# Altium project ChipTestBoardQFN32-r2.PrjPcb
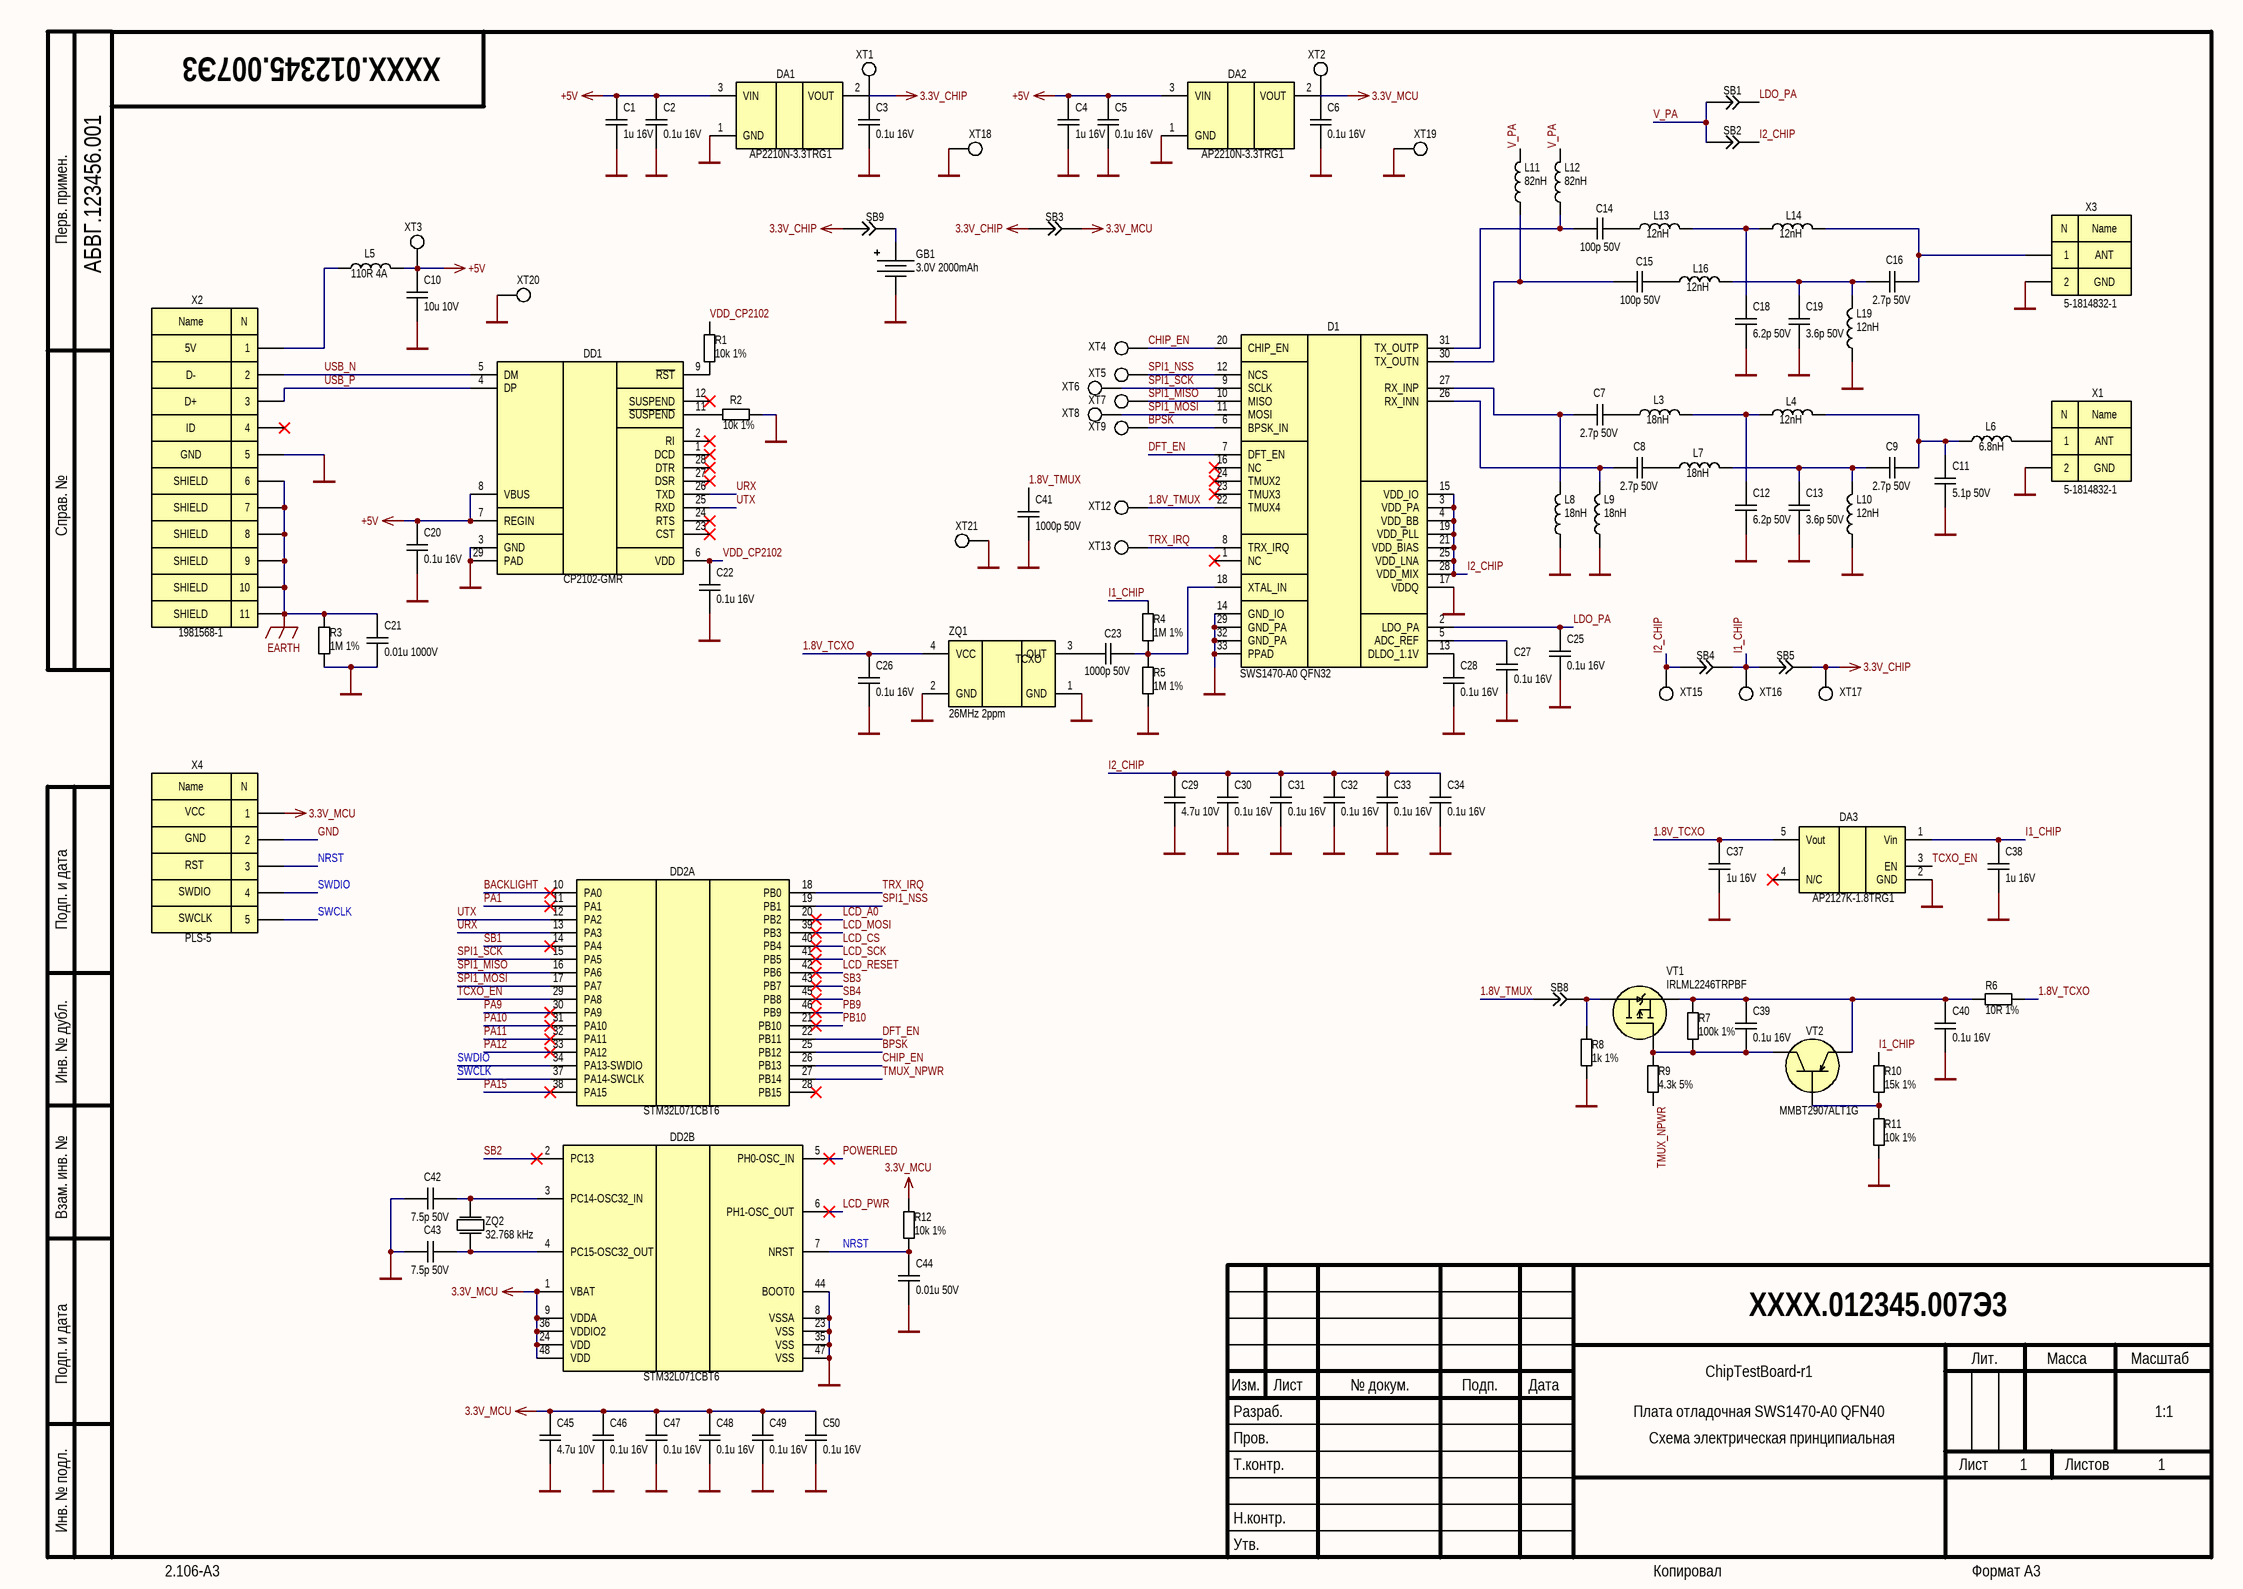
[diagram p0: ChipTestBoardQFN32-r2.SchDoc]
1 sheet, 112 parts. Net scope: global (net labels, ports and power ports of the same name join across sheets).
Board file: ChipTestBoardQFN32-r2.PcbDoc

## Sheet ChipTestBoardQFN32-r2.SchDoc: ChipTestBoard-r1
size 420 x 297 mm; DocumentNumber: XXXX.012345.007Э3; SheetNumber: 1; SheetTotal: 1; Scale: 1:1; Title2str: Плата отладочная SWS1470-A0 QFN40; DocumentType: Схема электрическая принципиальная; FirstReferrence: АБВГ.123456.001

### Parts
C1  1u 16V  [C0603]
C2  0.1u 16V  [C0603]
C3  0.1u 16V  [C0603]
C4  1u 16V  [C0603]
C5  0.1u 16V  [C0603]
C6  0.1u 16V  [C0603]
C7  2.7p 50V  [C0603]
C8  2.7p 50V  [C0603]
C9  2.7p 50V  [C0603]
C10  10u 10V  [C0805]
C11  5.1p 50V  [C0603]
C12  6.2p 50V  [C0603]
C13  3.6p 50V  [C0603]
C14  100p 50V  [C0603]
C15  100p 50V  [C0603]
C16  2.7p 50V  [C0603]
C18  6.2p 50V  [C0603]
C19  3.6p 50V  [C0603]
C20  0.1u 16V  [C0603]
C21  0.01u 1000V  [C1206]
C22  0.1u 16V  [C0603]
C23  1000p 50V  [C0603]
C25  0.1u 16V  [C0603]
C26  0.1u 16V  [C0603]
C27  0.1u 16V  [C0603]
C28  0.1u 16V  [C0603]
C29  4.7u 10V  [C0603]
C30  0.1u 16V  [C0603]
C31  0.1u 16V  [C0603]
C32  0.1u 16V  [C0603]
C33  0.1u 16V  [C0603]
C34  0.1u 16V  [C0603]
C37  1u 16V  [C0603]
C38  1u 16V  [C0603]
C39  0.1u 16V  [C0603]
C40  0.1u 16V  [C0603]
C41  1000p 50V  [C0603]
C42  7.5p 50V  [C0603]
C43  7.5p 50V  [C0603]
C44  0.01u 50V  [C0603]
C45  4.7u 10V  [C0603]
C46  0.1u 16V  [C0603]
C47  0.1u 16V  [C0603]
C48  0.1u 16V  [C0603]
C49  0.1u 16V  [C0603]
C50  0.1u 16V  [C0603]
D1  SWS1470-A0 QFN32  [QFN32]
DA1  AP2210N-3.3TRG1  [SOT23-3L]
DA2  AP2210N-3.3TRG1  [SOT23-3L]
DA3  AP2127K-1.8TRG1  [SOT23-5]
DD1  CP2102-GMR  [QFN28]
DD2  STM32L071CBT6  [LQFP48_L]  (parts A,B of 2)
GB1  3.0V 2000mAh  [BAT14505-Board]
L3  18nH  [L0603_LQW]
L4  12nH  [L0603_LQW]
L5  110R 4A  [L1806]
L6  6.8nH  [L0603_LQW]
L7  18nH  [L0603_LQW]
L8  18nH  [L0603_LQW]
L9  18nH  [L0603_LQW]
L10  12nH  [L0603_LQW]
L11  82nH  [L0603_LQW]
L12  82nH  [L0603_LQW]
L13  12nH  [L0603_LQW]
L14  12nH  [L0603_LQW]
L16  12nH  [L0603_LQW]
L19  12nH  [L0603_LQW]
R1  10k 1%  [R0603]
R2  10k 1%  [R0603]
R3  1M 1%  [R0603]
R4  1M 1%  [R0603]
R5  1M 1%  [R0603]
R6  10R 1%  [R0603]
R7  100k 1%  [R0603]
R8  1k 1%  [R0603]
R9  4.3k 5%  [R0603]
R10  15k 1%  [R0603]
R11  10k 1%  [R0603]
R12  10k 1%  [R0603]
SB1  Jumper Solder  [SB0805]  (value not drawn)  (no BOM)
SB2  Jumper Solder  [SB0805]  (value not drawn)  (no BOM)
SB3  Jumper Solder  [SB0805]  (value not drawn)  (no BOM)
SB4  Jumper Solder  [SB0805]  (value not drawn)  (no BOM)
SB5  Jumper Solder  [SB0805]  (value not drawn)  (no BOM)
SB8  Jumper Solder  [SB0805]  (value not drawn)  (no BOM)
SB9  Jumper Solder  [SB0805]  (value not drawn)  (no BOM)
VT1  IRLML2246TRPBF  [SOT23-3L]
VT2  MMBT2907ALT1G  [SOT23-3L]
X1  5-1814832-1  [5-1814832-1]
X2  1981568-1  [1981568-1]
X3  5-1814832-1  [5-1814832-1]
X4  PLS-5  [PLS-5-2.54-PCB]
XT1  3.3V_MCU  [PAD-d1.0-x1.6-y1.6]  (value not drawn)  (no BOM)
XT2  3.3V_CHIP  [PAD-d1.0-x1.6-y1.6]  (value not drawn)  (no BOM)
XT3  +5V_EXT  [PAD-d1.0-x1.6-y1.6]  (value not drawn)  (no BOM)
XT4  CHIP_EN  [PAD-d1.0-x1.6-y1.6]  (value not drawn)  (no BOM)
XT5  NSS  [PAD-d1.0-x1.6-y1.6]  (value not drawn)  (no BOM)
XT6  SCK  [PAD-d1.0-x1.6-y1.6]  (value not drawn)  (no BOM)
XT7  MISO  [PAD-d1.0-x1.6-y1.6]  (value not drawn)  (no BOM)
XT8  MOSI  [PAD-d1.0-x1.6-y1.6]  (value not drawn)  (no BOM)
XT9  BPSK_IN  [PAD-d1.0-x1.6-y1.6]  (value not drawn)  (no BOM)
XT12  1.8V_TMUX  [PAD-d1.0-x1.6-y1.6]  (value not drawn)  (no BOM)
XT13  TRX_IR  [PAD-d1.0-x1.6-y1.6]  (value not drawn)  (no BOM)
XT15  I2_CHIP  [PAD-d1.0-x1.6-y1.6]  (value not drawn)  (no BOM)
XT16  I1_CHIP  [PAD-d1.0-x1.6-y1.6]  (value not drawn)  (no BOM)
XT17  3.3V_CHIP  [PAD-d1.0-x1.6-y1.6]  (value not drawn)  (no BOM)
XT18  GND  [PAD-d1.0-x1.6-y1.6]  (value not drawn)  (no BOM)
XT19  GND  [PAD-d1.0-x1.6-y1.6]  (value not drawn)  (no BOM)
XT20  GND  [PAD-d1.0-x1.6-y1.6]  (value not drawn)  (no BOM)
XT21  GND  [PAD-d1.0-x1.6-y1.6]  (value not drawn)  (no BOM)
ZQ1  26MHz 2ppm  [QSMD2.0x1.6x0.7]
ZQ2  32.768 kHz  [QSMD3.2X1.5X0.8]

### Nets
3.3V_CHIP: C3.2 DA1.2(VOUT) SB3.1 SB5.2 SB9.1 XT1.1 XT17.1
3.3V_MCU: C6.2 C45.2 C46.2 C47.2 C48.2 C49.2 C50.2 DA2.2(VOUT) DD2.1(VBAT) DD2.9(VDDA) DD2.24(VDD) DD2.36(VDDIO2) DD2.48(VDD) R12.2 SB3.2 X4.1 XT2.1
+5V: C1.2 C2.2 C4.2 C5.2 C10.2 C20.2 DA1.3(VIN) DA2.3(VIN) DD1.7(REGIN) DD1.8(VBUS) L5.2 XT3.1
EARTH: C21.1 R3.2 X2.6 X2.7 X2.8 X2.9 X2.10 X2.11
GND: C1.1 C2.1 C3.1 C4.1 C5.1 C6.1 C10.1 C11.1 C12.2 C13.2 C18.2 C19.2 C20.1 C21.2 C22.1 C25.1 C26.1 C27.1 C28.1 C29.1 C30.1 C31.1 C32.1 C33.1 C34.1 C37.1 C38.1 C40.1 C41.2 C42.1 C43.1 C44.1 C45.1 C46.1 C47.1 C48.1 C49.1 C50.1 D1.14(GND_IO) D1.17(VDDQ) D1.29(GND_PA) D1.32(GND_PA) D1.33(PPAD) DA1.1(GND) DA2.1(GND) DA3.2(GND) DD1.3(GND) DD1.29(PAD) DD2.8(VSSA) DD2.23(VSS) DD2.35(VSS) DD2.44(BOOT0) DD2.47(VSS) GB1.2 L8.1 L9.1 L10.1 L19.1 R2.1 R3.1 R5.1 R8.1 R11.1 X1.2 X2.5 X3.2 X4.2 XT18.1 XT19.1 XT20.1 XT21.1 ZQ1.1(GND) ZQ1.2(GND)
1.8V_TCXO: C26.2 C37.2 DA3.5(Vout) R6.2 ZQ1.4(VCC)
1.8V_TMUX: C41.1 D1.22(TMUX4) SB8.1 XT12.1
BACKLIGHT: DD2.10(PA0)
BPSK: D1.6(BPSK_IN) DD2.25(PB12) XT9.1
CHIP_EN: D1.20(CHIP_EN) DD2.26(PB13) XT4.1
DFT_EN: D1.7(DFT_EN) DD2.22(PB11)
I1_CHIP: C38.2 DA3.1(Vin) R4.2 R10.2 SB4.2 SB5.1 XT16.1
I2_CHIP: C29.2 C30.2 C31.2 C32.2 C33.2 C34.2 D1.3(VDD_PA) D1.4(VDD_BB) D1.15(VDD_IO) D1.19(VDD_PLL) D1.21(VDD_BIAS) D1.25(VDD_LNA) D1.28(VDD_MIX) SB2.2 SB4.1 XT15.1
LCD_A0: DD2.20(PB2)
LCD_CS: DD2.40(PB4)
LCD_MOSI: DD2.39(PB3)
LCD_PWR: DD2.6(PH1-OSC_OUT)
LCD_RESET: DD2.42(PB6)
LCD_SCK: DD2.41(PB5)
LDO_PA: C25.2 D1.2(LDO_PA) SB1.2
NRST: C44.2 DD2.7(NRST) R12.1 X4.3
PA1: DD2.11(PA1)
PA9: DD2.30(PA9)
PA10: DD2.31(PA10)
PA11: DD2.32(PA11)
PA12: DD2.33(PA12)
PA15: DD2.38(PA15)
PB9: DD2.46(PB9)
PB10: DD2.21(PB10)
POWERLED: DD2.5(PH0-OSC_IN)
SB1: DD2.14(PA4)
SB2: DD2.2(PC13)
SB3: DD2.43(PB7)
SB4: DD2.45(PB8)
SPI1_MISO: D1.10(MISO) DD2.16(PA6) XT7.1
SPI1_MOSI: D1.11(MOSI) DD2.17(PA7) XT8.1
SPI1_NSS: D1.12(NCS) DD2.19(PB1) XT5.1
SPI1_SCK: D1.9(SCLK) DD2.15(PA5) XT6.1
SWCLK: DD2.37(PA14-SWCLK) X4.5
SWDIO: DD2.34(PA13-SWDIO) X4.4
TCXO_EN: DA3.3(EN) DD2.29(PA8)
TMUX_NPWR: DD2.27(PB14) R9.1
TRX_IRQ: D1.8(TRX_IRQ) DD2.18(PB0) XT13.1
URX: DD1.26(TXD) DD2.13(PA3)
USB_N: DD1.5(DM) X2.2
USB_P: DD1.4(DP) X2.3
UTX: DD1.25(RXD) DD2.12(PA2)
V_PA: L11.2 L12.2 SB1.1 SB2.1
VDD_CP2102: C22.2 DD1.6(VDD) R1.2
NetC7_1: C7.1 D1.27(RX_INP) L8.2
NetC7_2: C7.2 L3.1
NetC8_1: C8.1 D1.26(RX_INN) L9.2
NetC8_2: C8.2 L7.1
NetC9_1: C9.1 C13.1 L7.2 L10.2
NetC9_2: C9.2 C11.2 L4.2 L6.1
NetC12_1: C12.1 L3.2 L4.1
NetC14_1: C14.1 D1.31(TX_OUTP) L12.1
NetC14_2: C14.2 L13.1
NetC15_1: C15.1 D1.30(TX_OUTN) L11.1
NetC15_2: C15.2 L16.1
NetC16_1: C16.1 C19.1 L16.2 L19.2
NetC16_2: C16.2 L14.2 X3.1
NetC18_1: C18.1 L13.2 L14.1
NetC23_1: C23.1 D1.18(XTAL_IN) R4.1 R5.2
NetC23_2: C23.2 ZQ1.3(OUT)
NetC27_2: C27.2 D1.5(ADC_REF)
NetC28_2: C28.2 D1.13(DLDO_1.1V)
NetC39_1: C39.1 R7.1 R9.2 VT1.1(G) VT2.3
NetC39_2: C39.2 C40.2 R6.1 R7.2 VT1.2(S) VT2.2
NetC42_2: C42.2 DD2.3(PC14-OSC32_IN) ZQ2.1
NetC43_2: C43.2 DD2.4(PC15-OSC32_OUT) ZQ2.3
NetDD1_9: DD1.9(~{RST}) R1.1
NetDD1_11: DD1.11(~{SUSPEND}) R2.2
NetGB1_1: GB1.1 SB9.2
NetL5_1: L5.1 X2.1
NetL6_2: L6.2 X1.1
NetR8_2: R8.2 SB8.2 VT1.3(D)
NetR10_1: R10.1 R11.2 VT2.1

Not connected (* = marked no-connect by the designer): D1 1(NC)* 16(NC)* 23(TMUX3)* 24(TMUX2)*; DA3 4(N/C)*; DD1 1(DCD)* 2(RI)* 12(SUSPEND)* 23(CST)* 24(RTS)* 27(DSR)* 28(DTR)*; DD2 28(PB15)*; X2 4*

### Notes on the sheet
- RST
- GND
- VCC
- (near X4) SWDIO
- (near X4) SWCLK
- Перв. примен.
- Справ. №
- Подп. и дата
- Инв. № дубл.
- Взам. инв. №
- Разраб.
- Изм.
- Лист
- № докум.
- Подп.
- Дата
- Лит.
- Масса
- Масштаб
- Пров.
- Т.контр.
- Листов
- Инв. № подл.
- Утв.
- Н.контр.
- 2.106-A3
- Копировал
- Формат А3
- (in symbol 5-1814832-1) N; Name; ANT; GND
- (in symbol 1981568-1) Name; N; 5V; D-; D+; ID; GND; SHIELD
- (in symbol NT2016SA-26.000000MHZ-NBG2) TCXO
- (in symbol PLS-5) Name; N

### Library data of the parts
C1 C4 C37 C38 = CC0603KRX7R7BB105: CERCAP 1/16V 0603 KX7R; PartNumber: CC0603KRX7R7BB105
C2 C3 C5 C6 C20 C22 C25-C28 C30-C34 C39 C40 C46-C50 = CC0603KRX7R7BB104: CERCAP 0.1/16V 0603 KX7R; PartNumber: CC0603KRX7R7BB104
C7-C9 C16 = CC0603BRNPO9BN2R7: CERCAP 2.7p/50V 0603 BNPO; PartNumber: CC0603BRNPO9BN2R7
C10 = CL21A106KPFNNNG: 10µF ±10% 10V Ceramic Capacitor X5R 0805 (2012 Metric); PartNumber: CL21A106KPFNNNG
C11 = CC0603CRNPO9BN5R1: 5.1pF ±0.25pF 50V Ceramic Capacitor C0G, NP0 0603 (1608 Metric); PartNumber: CC0603CRNPO9BN5R1
C12 C18 = CC0603BRNPO9BN6R2: CERCAP 6.2p/50V 0603 BNPO; PartNumber: CC0603BRNPO9BN6R2
C13 C19 = CC0603BRNPO9BN3R6: CERCAP 3.6p/50V 0603 BNPO; PartNumber: CC0603BRNPO9BN3R6
C14 C15 = CC0603JRNPO9BN101: CERCAP 100p/50V 0603 JX7R; PartNumber: CC0603JRNPO9BN101
C21 = CC1206KKX7RCBB103: CAP CER 10000PF 1KV X7R 1206; PartNumber: CC1206KKX7RCBB103
C23 C41 = CC0603JRNPO9BN102: CERCAP 1000p/50V 0603 JNPO; PartNumber: CC0603JRNPO9BN102
C29 C45 = CC0603KRX5R6BB475: CERCAP 4.7/10V 0603 KX5R; PartNumber: CC0603KRX5R6BB475
C42 C43 = CC0603CRNPO9BN7R5: CAP CER 7.5PF 50V NPO 0603; PartNumber: CC0603CRNPO9BN7R5
C44 = CC0603KRX7R9BB103: CAP CER 10000PF 50V X7R 0603; PartNumber: CC0603KRX7R9BB103
D1 = SWS1470-A0 QFN32: Waviot NB-Fi RF Transceiver QFN32; PartNumber: SWS1470-A0 QFN32
DA1 DA2 = AP2210N-3.3TRG1: IC REG LINEAR 3.3V 300MA SOT23-3; PartNumber: AP2210N-3.3TRG1
DA3 = AP2127K-1.8TRG1: LDO Voltage Regulators 1.8V 80mA CMOS LDO w/Enable; PartNumber: AP2127K-1.8TRG1
DD1 = CP2102-GMR: IC USB-TO-UART BRIDGE 28VQFN; PartNumber: CP2102-GMR
DD2 = STM32L071CBT6: ARM Microcontrollers - MCU Ultra-low-power ARM Cortex-M0+ MCU with 64/192-Kbytes Flash, 32 MHz CPU; PartNumber: STM32L071CBT6
GB1 = CR14505BL-AX: Lithium Battery CR14505 3.0V 2000mAh -30..75C; PartNumber: CR14505BL-AX
L3 L7-L9 = LQW18AN18NG00D: FIXED IND 18NH 550MA 160 MOHM; PartNumber: LQW18AN18NG00D
L4 L10 L13 L14 L16 L19 = LQW18AN12NG00D: FIXED IND 12NH 600MA 130 MOHM; PartNumber: LQW18AN12NG00D
L5 = FBMJ4516HS111-T: FERRITE BEAD 110 OHM 1806 1LN; PartNumber: FBMJ4516HS111-T
L6 = LQW18AN6N8C00D: FIXED IND 6.8NH 750MA 82 MOHM; PartNumber: LQW18AN6N8C00D
L11 L12 = LQW18AN82NG00D: FIXED IND 82NH 250MA 600 MOHM; PartNumber: LQW18AN82NG00D
R1 R2 R11 R12 = RC0603FR-0710KL: RES 0603 10K 1%; PartNumber: RC0603FR-0710KL
R3-R5 = RC0603FR-071ML: 1 MOhms ±1% 0.1W, 1/10W Chip Resistor 0603 (1608 Metric) Moisture Resistant Thick Film; PartNumber: RC0603FR-071ML
R6 = RC0603FR-0710RL: RES SMD 10 OHM 1% 1/10W 0603; PartNumber: RC0603FR-0710RL
R7 = RC0603FR-07100KL: 100 kOhms ±1% 0.1W, 1/10W Chip Resistor 0603 (1608 Metric) Moisture Resistant Thick Film; PartNumber: RC0603FR-07100KL
R8 = RC0603FR-071KL: RES 0603 1K 1%; PartNumber: RC0603FR-071KL
R9 = RC0603JR-074K3L: RES 0603 4.3K 5%; PartNumber: RC0603JR-074K3L
R10 = RC0603FR-0715KL: RES 0603 15K 1%; PartNumber: RC0603FR-0715KL
SB1-SB5 SB8 SB9 = JS_0805: Jumper Solder 0805; Value: *
VT1 = IRLML2246TRPBF: MOSFET MOSFT PCh -20V -2.6A 135mOhm -2.5V cpbl; PartNumber: IRLML2246TRPBF
VT2 = MMBT2907ALT1G: TRANS PNP 60V 0.6A SOT23; PartNumber: MMBT2907ALT1G
X1 X3 = 5-1814832-1: CONN SMA JACK STR 50 OHM PCB; PartNumber: 5-1814832-1
X2 = 1981568-1: CONN RCPT USB2.0 MICRO B SMD R/A; PartNumber: 1981568-1
X4 = PLS-5: PLS-5-2.54; PartNumber: PLS-5
XT1-XT9 XT12 XT13 XT15-XT21 = PIN
ZQ1 = NT2016SA-26.000000MHZ-NBG2: TCXO Oscillator 4-pin; PartNumber: NT2016SA-26.000000MHZ-NBG2
ZQ2 = KX-327NHT 32.768 kHz: Crystals 32.768KHz 12.5pF -40C +85C; PartNumber: KX-327NHT 32.768 kHz